# Altium schematic sheet 05_ElectronicScales.SchDoc
size A4
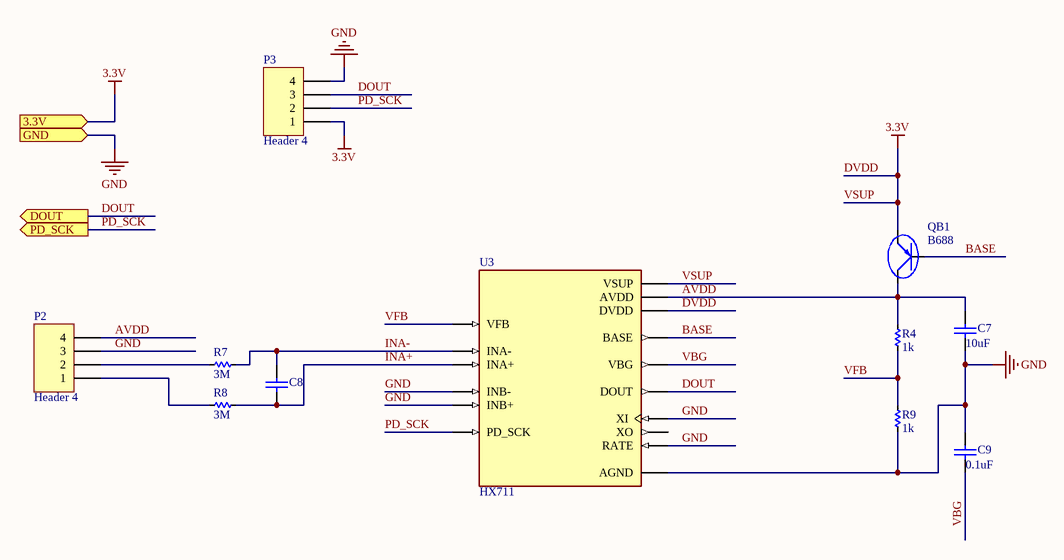
[diagram p0: 05_ElectronicScales.SchDoc]

## Parts
C7  10uF  [C0805]
C8  Capacitor Ceramic  [C0805]  (value not drawn)
C9  0.1uF  [C0805]
P2  Header 4  [HDR1X4]
P3  Header 4  [HDR1X4]
QB1  B688  [QTO-247]
R4  1k  [RES-SMD-0805]
R7  3M  [RES-SMD-0805]
R8  3M  [RES-SMD-0805]
R9  1k  [RES-SMD-0805]
U3  HX711  [SOP127P600X180-16N]

## Ports
3.3V (in), DOUT (out), GND (in), PD_SCK (out)

## Nets
DVDD: P3.1 QB1.3(E) U3.1(VSUP) U3.16(DVDD) ; port 3.3V  [also labelled 3.3V, VSUP]
GND: C7.1 C9.2 P2.3 P3.4 R9.2 U3.5(AGND) U3.9(INB-) U3.10(INB+) U3.14(XI) U3.15(RATE) ; port GND
AVDD: C7.2 P2.4 QB1.2(C) R4.1 U3.3(AVDD)
BASE: QB1.1(B) U3.2(BASE)
DOUT: P3.3 U3.12(DOUT) ; port DOUT
INA+: C8.1 R8.2 U3.8(INA+)
INA-: C8.2 R7.2 U3.7(INA-)
PD_SCK: P3.2 U3.11(PD_SCK) ; port PD_SCK
VBG: C9.1 U3.6(VBG)
VFB: R4.2 R9.1 U3.4(VFB)
NetP2_1: P2.1 R8.1
NetP2_2: P2.2 R7.1

Not connected (* = marked no-connect by the designer): U3 13(XO)

## Notes on the sheet
- Project:
- MANDevices
- Page Contents:
- Size:
- Date:
- A4
- Checked by:
- Time:
- Revision:
- Sheet
- of
- HaNoi University of
- Science and Technology
- File:

## Library data of the parts
C7-C9 = CapSMD: Capacitor; Value: 33p; Published: 8-Jun-2000; LatestRevisionDate: 17-Jul-2002; LatestRevisionNote: Re-released for DXP Platform.; PackageReference: RAD-0.3; Publisher: Altium Limited
P2 P3 = Header 4: Header, 4-Pin; LatestRevisionDate: 17-Jul-2002; LatestRevisionNote: Re-released for DXP Platform.; Publisher: Altium Limited
QB1 = B688: Transistor Power Supply; Value: B688
R4 R7-R9 = Res-SMD: Resistor; Manufacturer: Generic Components; Class: Passive; Published: 08/06/2000; Publisher: Altium Hobart Technology Centre
U3 = HX711: Value: *; Availability: Unavailable; Price: None; MP: HX711; Package: None